# Altium schematic sheet CAN 3V3new.SchDoc
size A
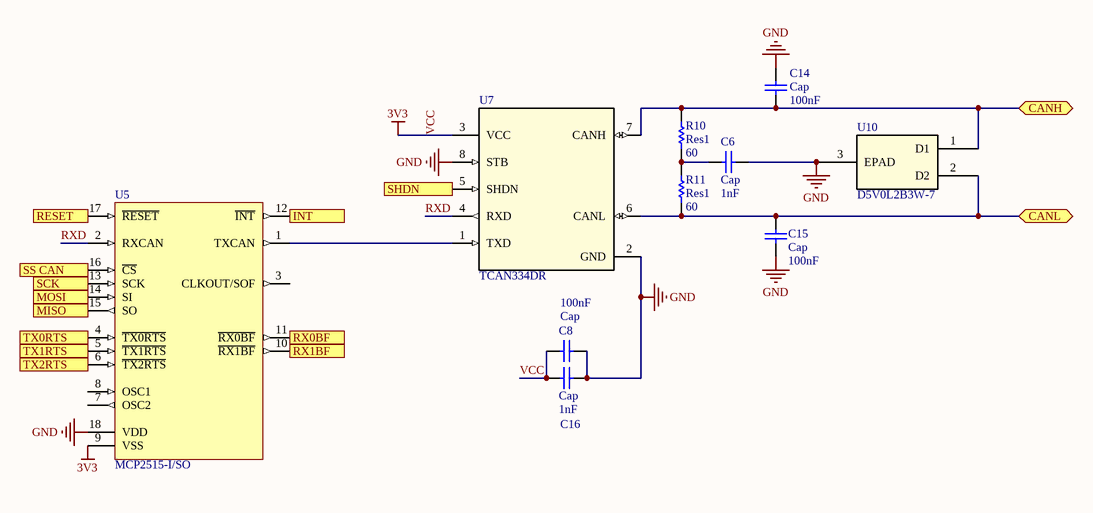
[diagram p0: CAN 3V3new.SchDoc]

## Parts
C6  Cap  value 1nF  [1608[0603]]
C8  Cap  value 100nF  [1608[0603]]
C14  Cap  value 100nF  [1608[0603]]
C15  Cap  value 100nF  [1608[0603]]
C16  Cap  value 1nF  [1608[0603]]
R10  Res1  value 60  [1608[0603]]
R11  Res1  value 60  [1608[0603]]
U5  MCP2515-I/SO  [SOIC-SO18_L]
U7  TCAN334DR  [D0008A_N]
U10  D5V0L2B3W-7  [SOT-323_DIO]

## Ports
CANH (bidir), CANL (bidir), INT (out), MISO (out), MOSI (in), RESET (in), RX0BF (out), RX1BF (out), SCK (in), SHDN (in), SS CAN (in), TX0RTS (in), TX1RTS (in), TX2RTS (in)

## Nets
GND: C6.2 C8.2 C14.1 C15.1 C16.1 U5.18(VDD) U7.2(GND) U7.8(STB) U10.3(EPAD)
VCC: C8.1 C16.2 U5.9(VSS) U7.3(VCC)  [also labelled 3V3]
CANH: C14.2 R10.1 U7.7(CANH) U10.1(D1) ; port CANH
CANL: C15.2 R11.1 U7.6(CANL) U10.2(D2) ; port CANL
INT: U5.12(~{INT}) ; port INT
MISO: U5.15(SO) ; port MISO
MOSI: U5.14(SI) ; port MOSI
RESET: U5.17(~{RESET}) ; port RESET
RX0BF: U5.11(~{RX0BF}) ; port RX0BF
RX1BF: U5.10(~{RX1BF}) ; port RX1BF
RXD: U5.2(RXCAN) U7.4(RXD)
SCK: U5.13(SCK) ; port SCK
SHDN: U7.5(SHDN) ; port SHDN
SS CAN: U5.16(~{CS}) ; port SS CAN
TX0RTS: U5.4(~{TX0RTS}) ; port TX0RTS
TX1RTS: U5.5(~{TX1RTS}) ; port TX1RTS
TX2RTS: U5.6(~{TX2RTS}) ; port TX2RTS
NetC6_1: C6.1 R10.2 R11.2
NetU5_1: U5.1(TXCAN) U7.1(TXD)

Not connected (* = marked no-connect by the designer): U5 3(CLKOUT/SOF) 7(OSC2) 8(OSC1)

## Library data of the parts
C6 C8 C14-C16 = Cap: Capacitor; Published: 8-Jun-2000; LatestRevisionDate: 17-Jul-2002; LatestRevisionNote: Re-released for DXP Platform.; PackageReference: RAD-0.3; Publisher: Altium Limited; PackageDescription: Radial Cap, Thru-Hole; 2 Leads; 0.3 in Pin Spacing
R10 R11 = Res1: Resistor; Published: 8-Jun-2000; LatestRevisionDate: 17-Jul-2002; LatestRevisionNote: Re-released for DXP Platform.; PackageReference: AXIAL-0.3; Publisher: Altium Limited; PackageDescription: Axial Device, Thru-Hole; 2 Leads; 0.3 in Pin Spacing
U5 = CMP-0186-00133-2: Stand-Alone CAN Controller With SPI Interface, 18-Pin SOIC, Industrial Temperature; ComponentLink2Description: Datasheet; RevisionNote: URLs added. DatasheetVersion updated.; PackageVersion: revBB, Aug-2009; ComponentLink1URL: http://www.microchip.com/; PackageReference: SOIC-SO18; PackageDescription: 18-Lead Plastic Small Outline (SO) - Wide 7.50mm Body [SOIC]; DatasheetVersion: revF, Oct-2010; ComponentLink2URL: http://ww1.microchip.com/downloads/en/DeviceDoc/21801f.pdf; ComponentLink3URL: http://www.microchip.com/stellent/groups/techpub_sg/documents/packagingspec/en012702.pdf; Code_JEDEC: MS-013; ComponentLink3Description: Package Specification; ComponentLink1Description: Manufacturer URL
U7 = TCAN334DR: No Description Available; Manufacturer: Texas Instruments; PartNumber: TCAN334DR; RefDes: RefDes; Type: DEV; Value: Value; Copyright: Copyright (C) 2018 Accelerated Designs. All rights reserved
U10 = D5V0L2B3W-7: No Description Available; Vendor: Diodes Inc; Built_By: EMA_UL_Team; SourceLibrary: DIODESINC_2_2015-08-18; Manufacturer_Part_Number: D5V0L2B3W-7; Copyright: Copyright (C) 2018 Accelerated Designs. All rights reserved; RefDes: RefDes; Type: DEV